# EAGLE schematic SwitchNode (EAGLE 7.2.0)
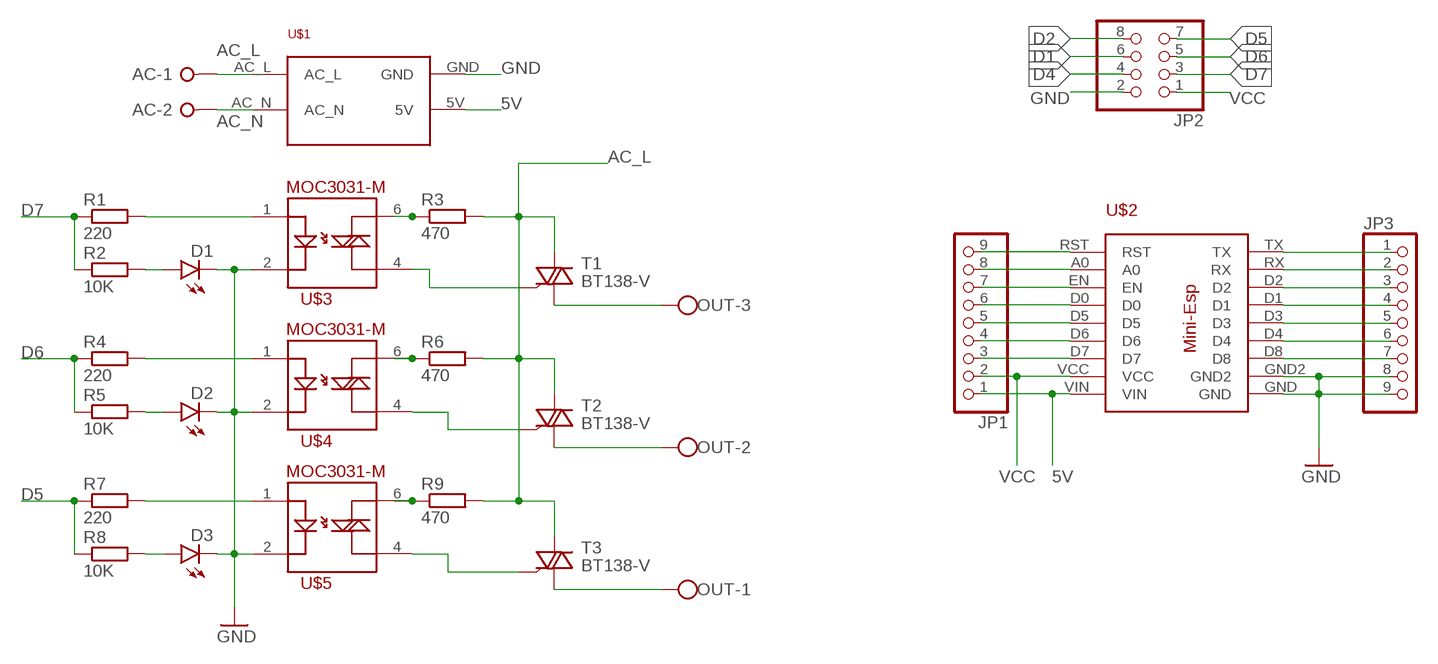
[diagram p0: schematic, sheet 1]

## Parts
AC  W237-02P  [W237-132]
D1  LED3MM  [LED3MM]
D2  LED3MM  [LED3MM]
D3  LED3MM  [LED3MM]
JP1  PINHD-1X9  [1X09-BIG]
JP2  PINHD-2X4  [2X04]
JP3  PINHD-1X9  [1X09-BIG]
OUT  W237-103  [W237-103]
R1  220  R-EU_R0805  [R0805]
R2  10K  R-EU_R0805  [R0805]
R3  470  R-EU_R0805  [R0805]
R4  220  R-EU_R0805  [R0805]
R5  10K  R-EU_R0805  [R0805]
R6  470  R-EU_R0805  [R0805]
R7  220  R-EU_R0805  [R0805]
R8  10K  R-EU_R0805  [R0805]
R9  470  R-EU_R0805  [R0805]
T1  BT138-V  [TO220BV]
T2  BT138-V  [TO220BV]
T3  BT138-V  [TO220BV]
U$1  POWER_SUPPLY_220VAC_5V  [POWER_SUPPLY_220VAC_5V]
U$2  MINI-ESP  [MINI-ESP]
U$3  MOC3031-M  [DIL06]
U$4  MOC3031-M  [DIL06]
U$5  MOC3031-M  [DIL06]

## Nets
5V: JP1.1 U$1.5V U$2.VIN
A0: JP1.8 U$2.A0
AC_L: AC.1 R3.2 R6.2 R9.2 T1.T2(A2) T2.T2(A2) T3.T2(A2) U$1.AC_L
AC_N: AC.2 U$1.AC_N
D0: JP1.6 U$2.D0
D1: JP2.6 JP3.4 U$2.D1
D2: JP2.8 JP3.3 U$2.D2
D3: JP3.5 U$2.D3
D4: JP2.4 JP3.6 U$2.D4
D5: JP1.5 JP2.7 R7.1 R8.1 U$2.D5
D6: JP1.4 JP2.5 R4.1 R5.1 U$2.D6
D7: JP1.3 JP2.3 R1.1 R2.1 U$2.D7
D8: JP3.7 U$2.D8
EN: JP1.7 U$2.EN
GND: D1.K(C) D2.K(C) D3.K(C) JP2.2 JP3.8 JP3.9 U$1.GND U$2.GND U$2.GND2 U$3.2 U$4.2 U$5.2
N$1: R1.2 U$3.1
N$4: R3.1 U$3.6
N$6: R4.2 U$4.1
N$7: D2.A R5.2
N$9: R6.1 U$4.6
N$10: T1.G U$3.4
N$11: T2.G U$4.4
N$12: R7.2 U$5.1
N$13: D3.A R8.2
N$14: OUT.2 T2.T1(A1)
N$15: R9.1 U$5.6
N$16: T3.G U$5.4
N$17: OUT.1 T3.T1(A1)
N$18: D1.A R2.2
N$19: OUT.3 T1.T1(A1)
RST: JP1.9 U$2.RST
RX: JP3.2 U$2.RX
TX: JP3.1 U$2.TX
VCC: JP1.2 JP2.1 U$2.VCC

## Library data of the parts
AC = con-wago-508:W237-02P: WAGO SREW CLAMP; OC_FARNELL: unknown; OC_NEWARK: unknown
D1-D3 = SparkFun-LED:LED: LEDs Standard schematic elements and footprints for 5mm, 3mm, 1206, and 0603 sized LEDs. 5mm - Spark Fun Electronics SKU : COM-00529 (and others)
JP1 JP3 = adafruit:PINHD-1X9: Pin header 1x10 0.1" spacing With round pins
JP2 = adafruit:PINHD-2X4: PIN HEADER
OUT = con-wago-500:W237-103: WAGO SCREW CLAMP; MPN: 237-103; OC_FARNELL: unknown; OC_NEWARK: 18M7116
R1-R9 = rcl:R-EU_: RESISTOR, European symbol
T1-T3 = triac:BT138: TRIAC Source: http://www.semiconductors.philips.com BT138_SERIES_2.pdf
U$1 = My Eagle Lib:POWER_SUPPLY_220VAC_5V
U$2 = My Eagle Lib:MINI-ESP
U$3-U$5 = SparkFun-DiscreteSemi:MOC3031-M: Opto-isolated TRIAC